# Altium schematic sheet 16.SchDoc
size 420 x 297 mm
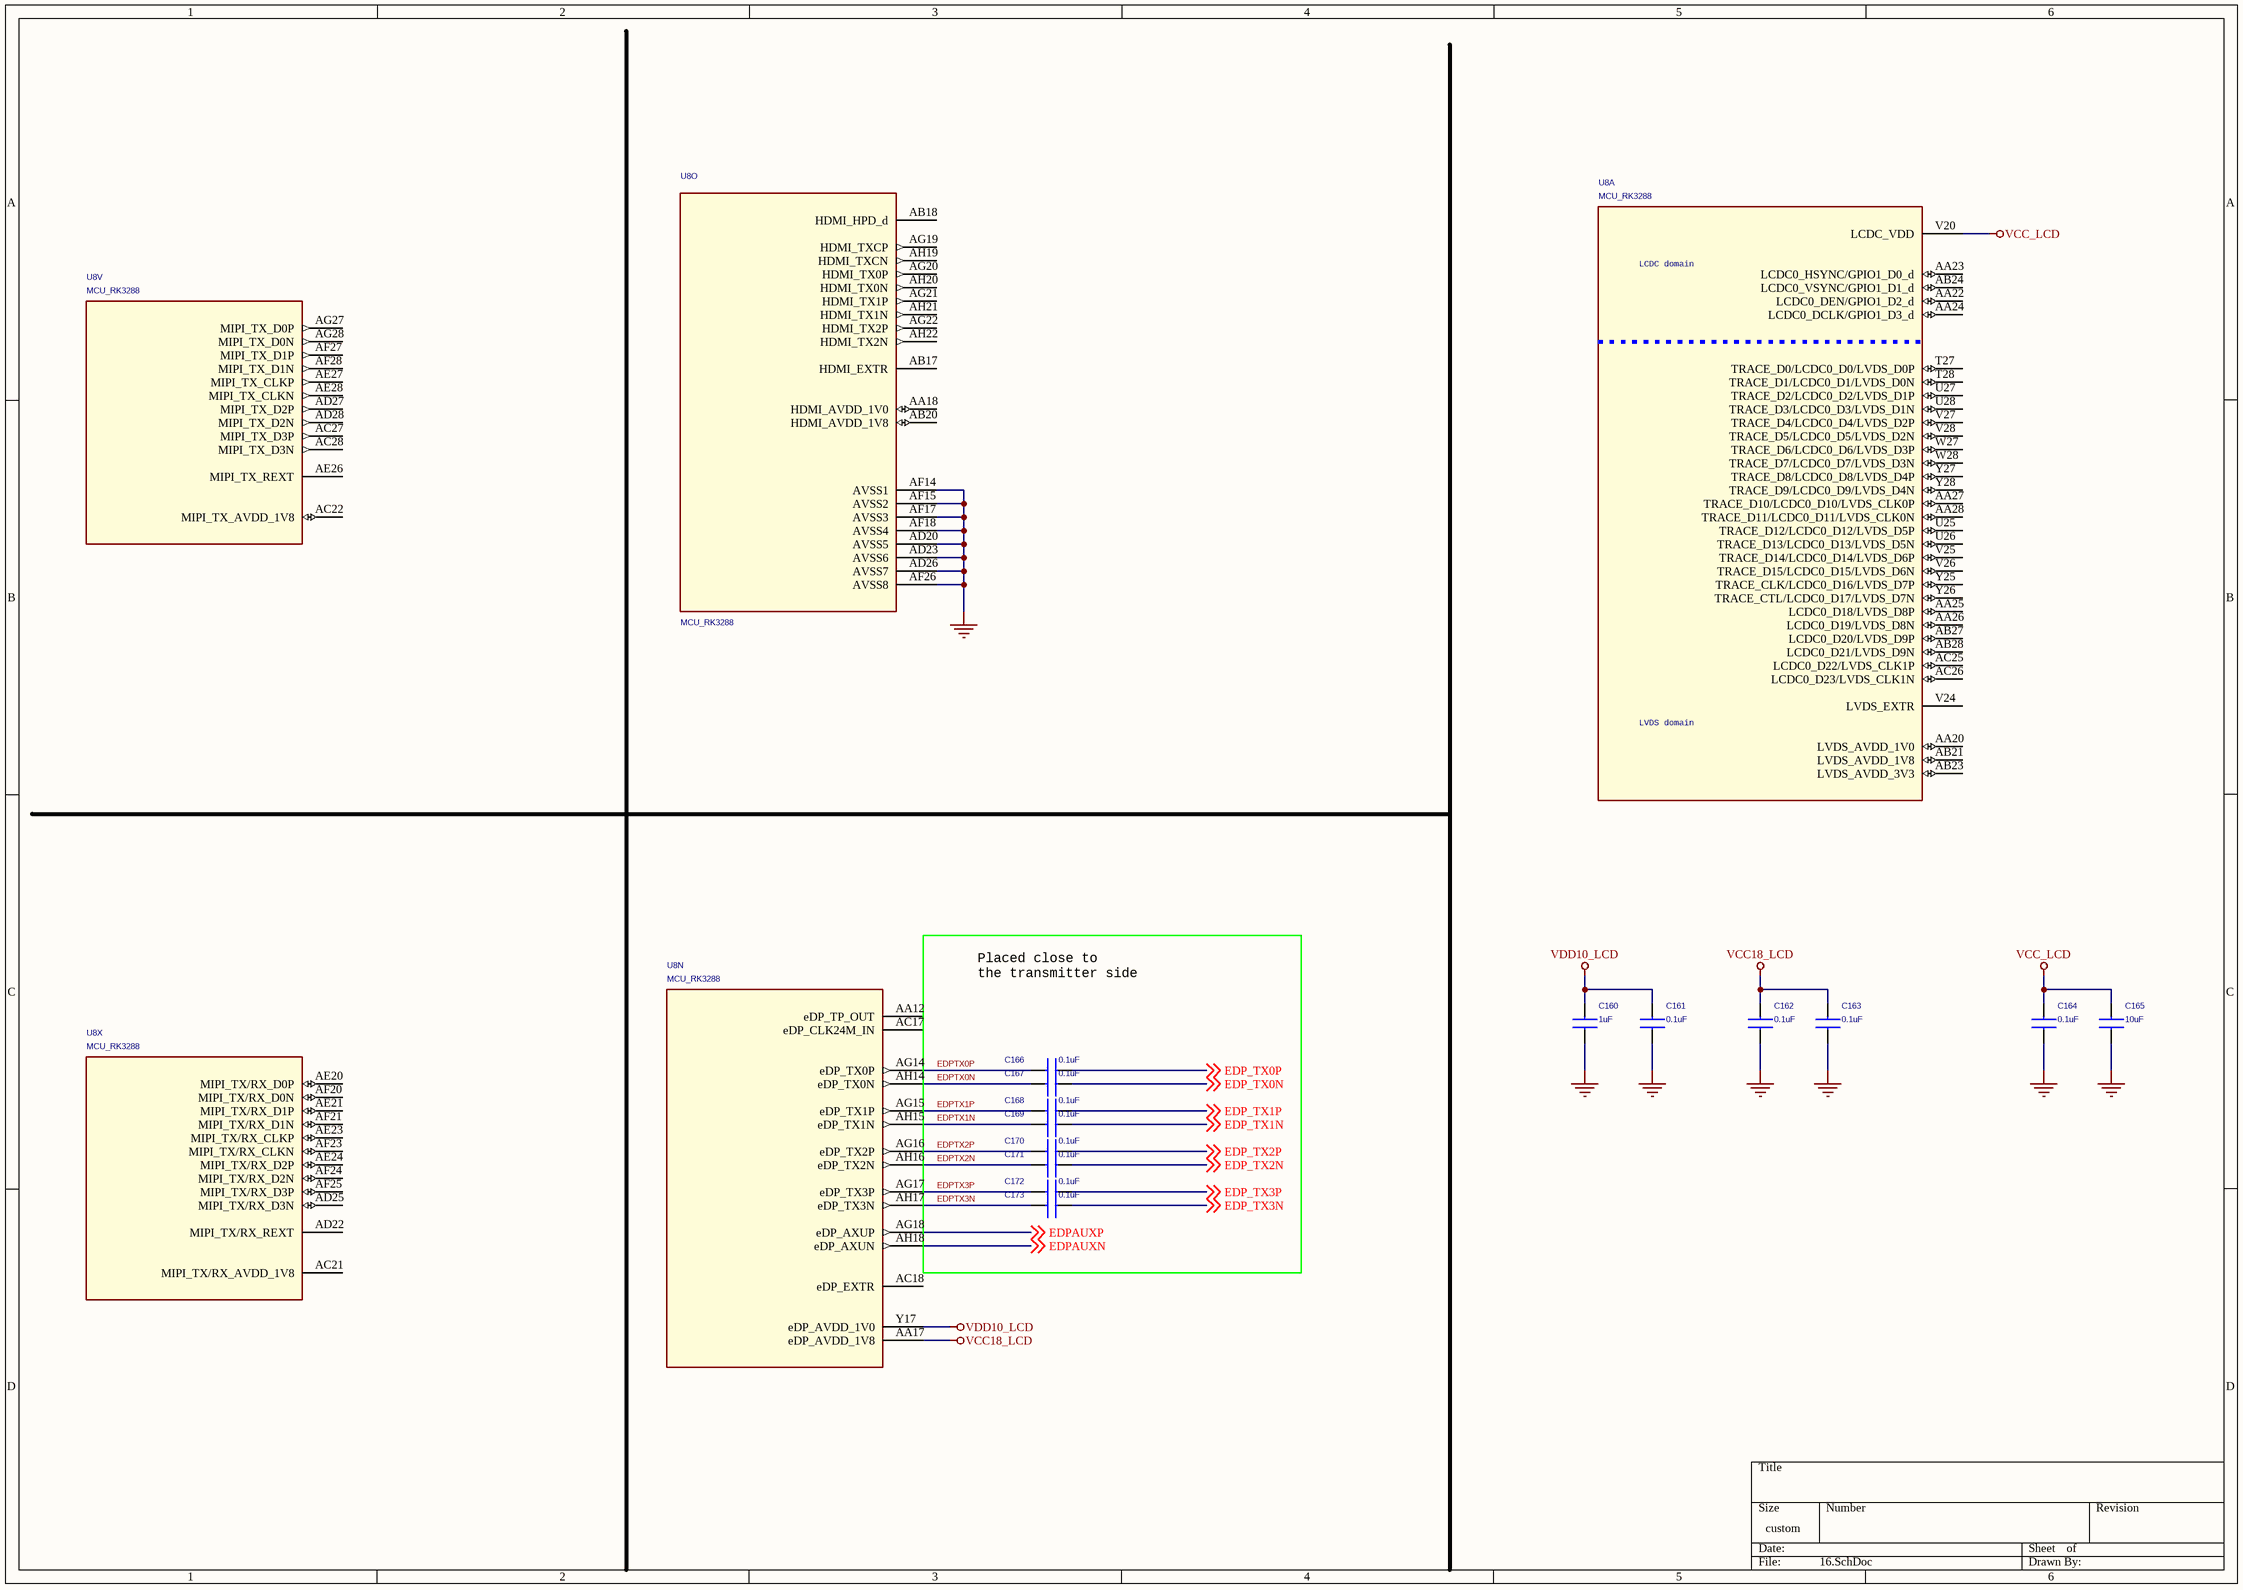
[diagram p0: 16.SchDoc]

## Parts
C160  1uF  [C0603]
C161  0.1uF  [C0603]
C162  0.1uF  [C0603]
C163  0.1uF  [C0603]
C164  0.1uF  [C0603]
C165  10uF  [C0603]
C166  0.1uF  [C0603]
C167  0.1uF  [C0603]
C168  0.1uF  [C0603]
C169  0.1uF  [C0603]
C170  0.1uF  [C0603]
C171  0.1uF  [C0603]
C172  0.1uF  [C0603]
C173  0.1uF  [C0603]
U8  MCU_RK3288  [BGA453-19X19]  (parts A,N,O,V,X of 24)

## Nets
GND: C160.2 C161.2 C162.2 C163.2 C164.2 C165.2 U8.AD20(AVSS5) U8.AD23(AVSS6) U8.AD26(AVSS7) U8.AF14(AVSS1) U8.AF15(AVSS2) U8.AF17(AVSS3) U8.AF18(AVSS4) U8.AF26(AVSS8)
VCC18_LCD: C162.1 C163.1 U8.AA17(eDP_AVDD_1V8)
VCC_LCD: C164.1 C165.1 U8.V20(LCDC_VDD)
VDD10_LCD: C160.1 C161.1 U8.Y17(eDP_AVDD_1V0)
EDP_TX0N: C167.2 ; off-sheet EDP_TX0N
EDP_TX0P: C166.2 ; off-sheet EDP_TX0P
EDP_TX1N: C169.2 ; off-sheet EDP_TX1N
EDP_TX1P: C168.2 ; off-sheet EDP_TX1P
EDP_TX2N: C171.2 ; off-sheet EDP_TX2N
EDP_TX2P: C170.2 ; off-sheet EDP_TX2P
EDP_TX3N: C173.2 ; off-sheet EDP_TX3N
EDP_TX3P: C172.2 ; off-sheet EDP_TX3P
EDPAUXN: U8.AH18(eDP_AXUN) ; off-sheet EDPAUXN
EDPAUXP: U8.AG18(eDP_AXUP) ; off-sheet EDPAUXP
EDPTX0N: C167.1 U8.AH14(eDP_TX0N)
EDPTX0P: C166.1 U8.AG14(eDP_TX0P)
EDPTX1N: C169.1 U8.AH15(eDP_TX1N)
EDPTX1P: C168.1 U8.AG15(eDP_TX1P)
EDPTX2N: C171.1 U8.AH16(eDP_TX2N)
EDPTX2P: C170.1 U8.AG16(eDP_TX2P)
EDPTX3N: C173.1 U8.AH17(eDP_TX3N)
EDPTX3P: C172.1 U8.AG17(eDP_TX3P)

Not connected (* = marked no-connect by the designer): U8 AA12(eDP_TP_OUT) AA18(HDMI_AVDD_1V0) AA20(LVDS_AVDD_1V0) AA22(LCDC0_DEN/GPIO1_D2_d) AA23(LCDC0_HSYNC/GPIO1_D0_d) AA24(LCDC0_DCLK/GPIO1_D3_d) AA25(LCDC0_D18/LVDS_D8P) AA26(LCDC0_D19/LVDS_D8N) AA27(TRACE_D10/LCDC0_D10/LVDS_CLK0P) AA28(TRACE_D11/LCDC0_D11/LVDS_CLK0N) AB17(HDMI_EXTR) AB18(HDMI_HPD_d) AB20(HDMI_AVDD_1V8) AB21(LVDS_AVDD_1V8) AB23(LVDS_AVDD_3V3) AB24(LCDC0_VSYNC/GPIO1_D1_d) AB27(LCDC0_D20/LVDS_D9P) AB28(LCDC0_D21/LVDS_D9N) AC17(eDP_CLK24M_IN) AC18(eDP_EXTR) AC21(MIPI_TX/RX_AVDD_1V8) AC22(MIPI_TX_AVDD_1V8) AC25(LCDC0_D22/LVDS_CLK1P) AC26(LCDC0_D23/LVDS_CLK1N) AC27(MIPI_TX_D3P) AC28(MIPI_TX_D3N) AD22(MIPI_TX/RX_REXT) AD25(MIPI_TX/RX_D3N) AD27(MIPI_TX_D2P) AD28(MIPI_TX_D2N) AE20(MIPI_TX/RX_D0P) AE21(MIPI_TX/RX_D1P) AE23(MIPI_TX/RX_CLKP) AE24(MIPI_TX/RX_D2P) AE26(MIPI_TX_REXT) AE27(MIPI_TX_CLKP) AE28(MIPI_TX_CLKN) AF20(MIPI_TX/RX_D0N) AF21(MIPI_TX/RX_D1N) AF23(MIPI_TX/RX_CLKN) AF24(MIPI_TX/RX_D2N) AF25(MIPI_TX/RX_D3P) AF27(MIPI_TX_D1P) AF28(MIPI_TX_D1N) AG19(HDMI_TXCP) AG20(HDMI_TX0P) AG21(HDMI_TX1P) AG22(HDMI_TX2P) AG27(MIPI_TX_D0P) AG28(MIPI_TX_D0N) AH19(HDMI_TXCN) AH20(HDMI_TX0N) AH21(HDMI_TX1N) AH22(HDMI_TX2N) T27(TRACE_D0/LCDC0_D0/LVDS_D0P) T28(TRACE_D1/LCDC0_D1/LVDS_D0N) U25(TRACE_D12/LCDC0_D12/LVDS_D5P) U26(TRACE_D13/LCDC0_D13/LVDS_D5N) U27(TRACE_D2/LCDC0_D2/LVDS_D1P) U28(TRACE_D3/LCDC0_D3/LVDS_D1N) V24(LVDS_EXTR) V25(TRACE_D14/LCDC0_D14/LVDS_D6P) V26(TRACE_D15/LCDC0_D15/LVDS_D6N) V27(TRACE_D4/LCDC0_D4/LVDS_D2P) V28(TRACE_D5/LCDC0_D5/LVDS_D2N) W27(TRACE_D6/LCDC0_D6/LVDS_D3P) W28(TRACE_D7/LCDC0_D7/LVDS_D3N) Y25(TRACE_CLK/LCDC0_D16/LVDS_D7P) Y26(TRACE_CTL/LCDC0_D17/LVDS_D7N) Y27(TRACE_D8/LCDC0_D8/LVDS_D4P) Y28(TRACE_D9/LCDC0_D9/LVDS_D4N)

## Notes on the sheet
- Placed close to
  the transmitter side
- (in symbol MCU_RK3288_3, part A) LCDC domain; LVDS domain

## Library data of the parts
C160-C164 C166-C173 = CAP NP_Dup3: CAP,MLCC,100nF,+/-10%,X7R,6.3V,SMD0402
C165 = CAP NP_Dup3: CAP,MLCC,4.7uF,+/-10%,X5R,6.3V,SMD0603
U8 = MCU_RK3288_3